# EAGLE design lc3dimmer (EAGLE 5.04)
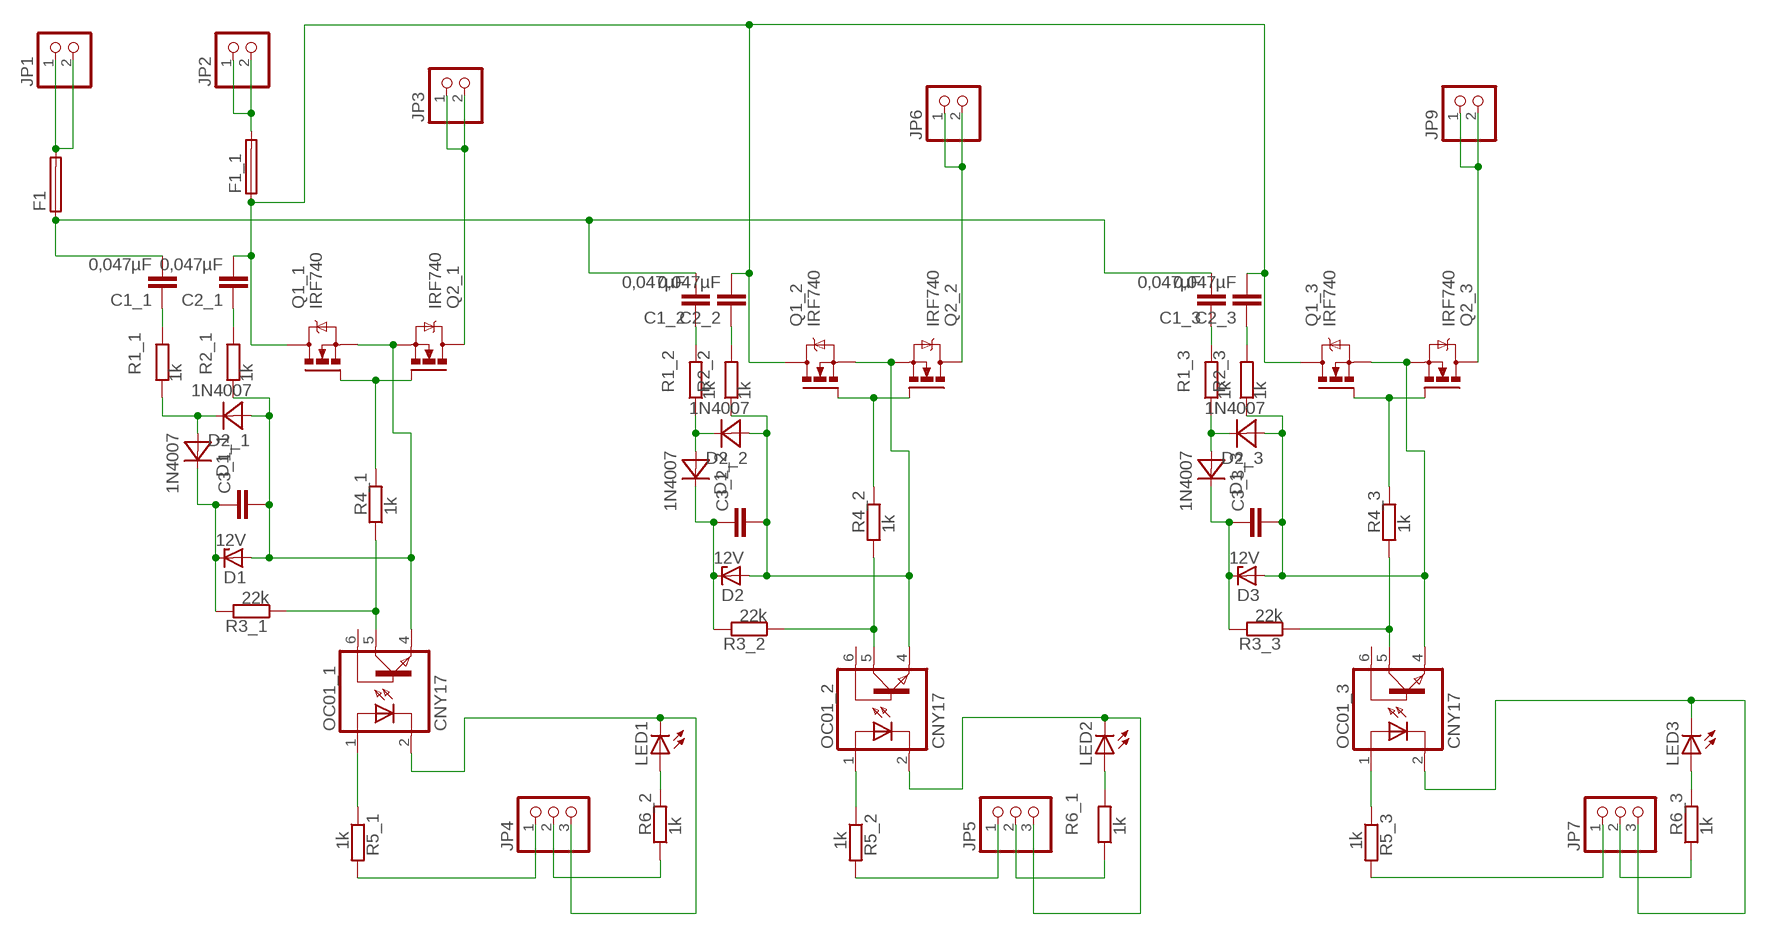
[diagram p0: schematic, sheet 1]

## Parts
C1_1  0,047µF  C-EU075-063X106  [C075-063X106]
C1_2  0,047µF  C-EU075-063X106  [C075-063X106]
C1_3  0,047µF  C-EU075-063X106  [C075-063X106]
C2_1  0,047µF  C-EU075-063X106  [C075-063X106]
C2_2  0,047µF  C-EU075-063X106  [C075-063X106]
C2_3  0,047µF  C-EU075-063X106  [C075-063X106]
C3_1  C-EUC1206  [C1206]
C3_2  C-EUC1206  [C1206]
C3_3  C-EUC1206  [C1206]
D1  12V  ZENER-DIODESOD80C  [SOD80C]
D1_1  1N4007  [DO41-7]
D1_2  1N4007  [DO41-7]
D1_3  1N4007  [DO41-7]
D2  12V  ZENER-DIODESOD80C  [SOD80C]
D2_1  1N4007  [DO41-7]
D2_2  1N4007  [DO41-7]
D2_3  1N4007  [DO41-7]
D3  12V  ZENER-DIODESOD80C  [SOD80C]
F1  19560  [19560]
F1_1  F457REICHELT  [PTF50]
JP1  PINHD-1X2  [1X02]
JP2  PINHD-1X2  [1X02]
JP3  PINHD-1X2  [1X02]
JP4  PINHD-1X3  [1X03]
JP5  PINHD-1X3  [1X03]
JP6  PINHD-1X2  [1X02]
JP7  PINHD-1X3  [1X03]
JP9  PINHD-1X2  [1X02]
LED1  LED3MM  [LED3MM]
LED2  LED3MM  [LED3MM]
LED3  LED3MM  [LED3MM]
OC01_1  CNY17  [DIL06]
OC01_2  CNY17  [DIL06]
OC01_3  CNY17  [DIL06]
Q1_1  IRF740  [TO220BV]
Q1_2  IRF740  [TO220BV]
Q1_3  IRF740  [TO220BV]
Q2_1  IRF740  [TO220BV]
Q2_2  IRF740  [TO220BV]
Q2_3  IRF740  [TO220BV]
R1_1  1k  R-EU_0207/10  [0207/10]
R1_2  1k  R-EU_0207/10  [0207/10]
R1_3  1k  R-EU_0207/10  [0207/10]
R2_1  1k  R-EU_0207/2V  [0207/2V]
R2_2  1k  R-EU_0207/10  [0207/10]
R2_3  1k  R-EU_0207/10  [0207/10]
R3_1  22k  R-EU_R1206  [R1206]
R3_2  22k  R-EU_R1206  [R1206]
R3_3  22k  R-EU_R1206  [R1206]
R4_1  1k  R-EU_0207/10  [0207/10]
R4_2  1k  R-EU_0207/10  [0207/10]
R4_3  1k  R-EU_0207/10  [0207/10]
R5_1  1k  R-EU_R1206  [R1206]
R5_2  1k  R-EU_R1206  [R1206]
R5_3  1k  R-EU_R1206  [R1206]
R6_1  1k  R-EU_R1206  [R1206]
R6_2  1k  R-EU_R1206  [R1206]
R6_3  1k  R-EU_R1206  [R1206]

## Nets
DIMMGND: C3_1.2 D1.A D2_1.A OC01_1.4(EMI) Q1_1.S Q2_1.S R2_1.1
DIMMGND1: C3_2.2 D2.A D2_2.A OC01_2.4(EMI) Q1_2.S Q2_2.S R2_2.1
DIMMGND2: C3_3.2 D2_3.A D3.A OC01_3.4(EMI) Q1_3.S Q2_3.S R2_3.1
GND: JP7.3 LED3.K(C) OC01_3.2(C)
N$1: F1_1.2 JP2.1 JP2.2
N$2: C1_1.1 R1_1.2
N$4: OC01_2.1(A) R5_2.1
N$5: OC01_2.5(COL) R3_2.1 R4_2.1
N$6: C2_1.1 R2_1.2
N$7: C1_2.1 R1_2.2
N$8: Q1_2.G Q2_2.G R4_2.2
N$9: C3_2.1 D1_2.C D2.C R3_2.2
N$10: D1_2.A D2_2.C R1_2.1
N$11: C2_2.1 R2_2.2
N$12: JP6.1 JP6.2 Q2_2.D
N$13: F1.2 JP1.1 JP1.2
N$14: OC01_3.1(A) R5_3.1
N$15: OC01_3.5(COL) R3_3.1 R4_3.1
N$16: JP3.1 JP3.2 Q2_1.D
N$18: C1_3.1 R1_3.2
N$19: Q1_3.G Q2_3.G R4_3.2
N$20: C3_3.1 D1_3.C D3.C R3_3.2
N$21: D1_3.A D2_3.C R1_3.1
N$22: C2_3.1 R2_3.2
N$23: JP9.1 JP9.2 Q2_3.D
N$24: LED1.A R6_2.2
N$25: LED2.A R6_1.2
N$26: JP4.2 R6_2.1
N$27: LED3.A R6_3.2
N$28: JP4.1 R5_1.2
N$29: JP5.1 R5_2.2
N$30: JP7.2 R6_3.1
N$31: JP5.3 LED2.K(C) OC01_2.2(C)
N$32: JP5.2 R6_1.1
N$33: JP7.1 R5_3.2
N$34: JP4.3 LED1.K(C) OC01_1.2(C)
N$37: OC01_1.1(A) R5_1.1
N$45: OC01_1.5(COL) R3_1.1 R4_1.1
N$47: Q1_1.G Q2_1.G R4_1.2
N$49: C3_1.1 D1.C D1_1.C R3_1.2
N$50: D1_1.A D2_1.C R1_1.1
NEUTRAL: C1_1.2 C1_2.2 C1_3.2 F1.1
PHASE: C2_1.2 C2_2.2 C2_3.2 F1_1.1 Q1_1.D Q1_2.D Q1_3.D
Unconnected: OC01_1.6(BAS) OC01_2.6(BAS) OC01_3.6(BAS)

## Library data of the parts
C1_1-C1_3 C2_1-C2_3 C3_1-C3_3 = rcl:C-EU: CAPACITOR, European symbol
D1-D3 = diode:ZENER-DIODE: Z-Diode
D1_1-D1_3 D2_1-D2_3 = diode:1N4007
F1 = fuse:19560: FUSE HOLDER TR5, Wickmann
F1_1 = fuse:F457: FUSE HOLDER CS, Schukat
JP1-JP3 JP6 JP9 = pinhead:PINHD-1X2: PIN HEADER
JP4 JP5 JP7 = pinhead:PINHD-1X3: PIN HEADER
LED1-LED3 = led:LED: LED OSRAM: - CHIPLED LG R971, LG N971, LY N971, LG Q971, LY Q971, LO R971, LY R971 LH N974, LH R974 LS Q976, LO Q976, LY Q976 LO Q996 - Hyper CHIPLED LW Q18S LB Q993, LB Q99A, LB R99A - SideLED LS A670, LO A670, LY A670, LG A670, LP A670 LB A673, LV A673, LT A673, LW A673 LH A674 LY A675 LS A676, LA A676, LO A676, LY A676, LW A676 LS A679, LY A679, LG A679 - Hyper Micro SIDELED® LS Y876, LA Y876, LO Y876, LY Y876 LT Y87S - SmartLED LW L88C, LW L88S LB L89C, LB L89S, LG L890 LS L89K, LO L89K, LY L89K LS L896, LA L896, LO L896, LY L896 - TOPLED LS T670, LO T670, LY T670, LG T670, LP T670 LSG T670, LSP T670, LSY T670, LOP T670, LYG T670 LG T671, LOG T671, LSG T671 LB T673, LV T673, LT T673, LW T673 LH T674 LS T676, LA T676, LO T676, LY T676, LB T676, LH T676, LSB T676, LW T676 LB T67C, LV T67C, LT T67C, LS T67K, LO T67K, LY T67K, LW E67C LS E67B, LA E67B, LO E67B, LY E67B, LB E67C, LV E67C, LT E67C LW T67C LS T679, LY T679, LG T679 LS T770, LO T770, LY T770, LG T770, LP T770 LB T773, LV T773, LT T773, LW T773 LH T774 LS E675, LA E675, LY E675, LS T675 LS T776, LA T776, LO T776, LY T776, LB T776 LHGB T686 LT T68C, LB T68C - Hyper Mini TOPLED® LB M676 - Mini TOPLED Santana® LG M470 LS M47K, LO M47K, LY M47K Source: http://www.osram.convergy.de - LUMILED® LXK2-PW12-R00, LXK2-PW12-S00, LXK2-PW14-U00, LXK2-PW14-V00 LXK2-PM12-R00, LXK2-PM12-S00, LXK2-PM14-U00 LXK2-PE12-Q00, LXK2-PE12-R00, LXK2-PE12-S00, LXK2-PE14-T00, LXK2-PE14-U00 LXK2-PB12-K00, LXK2-PB12-L00, LXK2-PB12-M00, LXK2-PB14-N00, LXK2-PB14-P00, LXK2-PB14-Q00 LXK2-PR12-L00, LXK2-PR12-M00, LXK2-PR14-Q00, LXK2-PR14-R00 LXK2-PD12-Q00, LXK2-PD12-R00, LXK2-PD12-S00 LXK2-PH12-R00, LXK2-PH12-S00 LXK2-PL12-P00, LXK2-PL12-Q00, LXK2-PL12-R00 Source: www.luxeon.com
OC01_1-OC01_3 = optocoupler:CNY17: SIEMENS OPTO COUPLER
Q1_1-Q1_3 Q2_1-Q2_3 = transistor-power:IRF740: N-CHANNEL MOS FET
R1_1-R1_3 R2_1-R2_3 R3_1-R3_3 R4_1-R4_3 R5_1-R5_3 R6_1-R6_3 = rcl:R-EU_: RESISTOR, European symbol

## Board
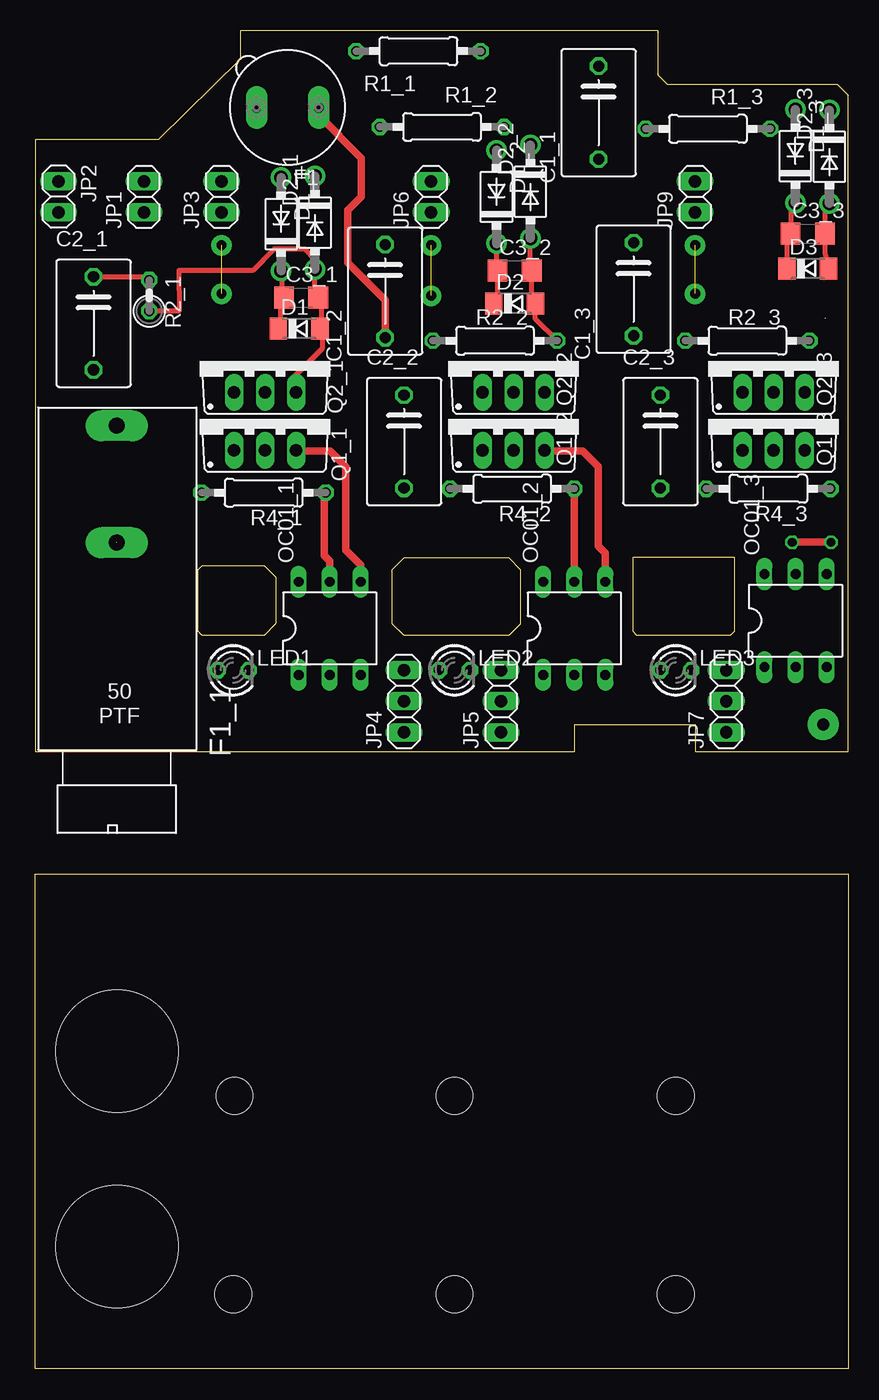
[diagram p1: board, top side]
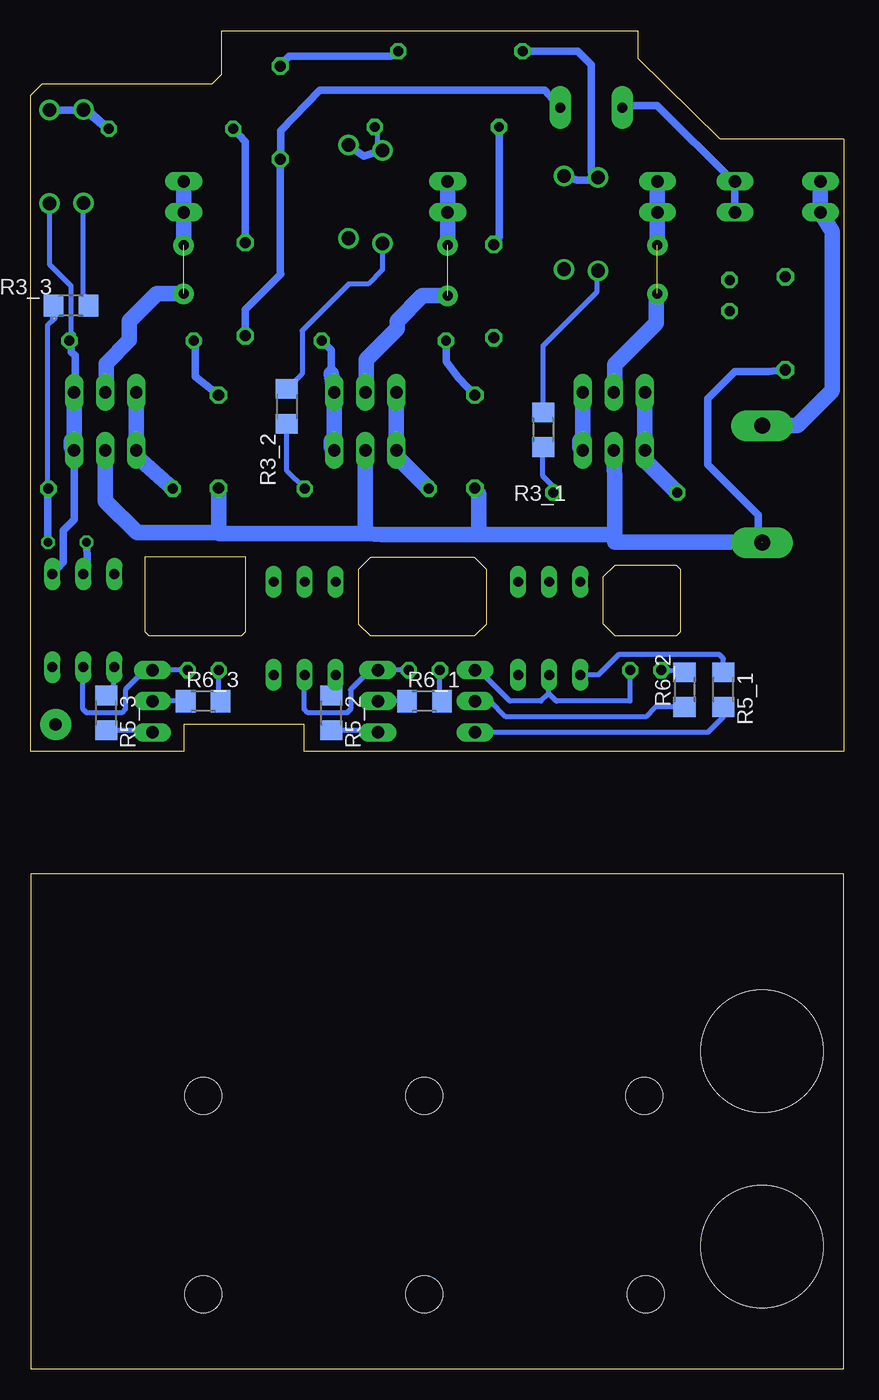
[diagram p2: board, bottom side, seen from below]

Size 66.5 x 109.5 mm. Coordinates in mm from the lower left corner, seen from the top.
Outline: 0,50.5 44.13,50.5 44.13,52.72 53.98,52.72 53.98,50.5 66.5,50.5 66.5,104.2 65.6,105.1 51.7,105.1 50.9,105.9 50.9,109.5 16.8,109.5 16.8,107.2 10.1,100.6 0,100.6 0,50.5
Outline: 48.9,60.34 48.9,66.41 57.15,66.41 57.15,60.34 56.83,60.02 49.21,60.02 48.9,60.34
Outline: 29.21,65.42 30.16,66.38 38.73,66.38 39.69,65.42 39.69,60.94 38.73,59.99 30.16,59.99 29.21,60.94 29.21,65.42
Outline: 13.65,65.74 18.73,65.74 19.68,64.79 19.68,60.98 18.73,60.02 13.65,60.02 13.34,60.34 13.34,65.42 13.65,65.74
Outline: 0,40.5 66.5,40.5 66.5,0 0,0 0,40.5
Copper layers (1*16): Top 0.035mm / dielectric 1.5mm / Bottom 0.035mm
Design rules "default": minimum track width 10mil, minimum drill 24mil, track to track 8mil, track to pad 8mil, pad to pad 8mil, via to via 8mil, smd to smd 8mil, copper to edge 40mil, drill to drill 8mil, minimum pad ring 10mil, minimum via ring 8mil, stop-mask expansion 4mil, vias tented up to drill 0mil, thermal gap 10mil
Holes 3 mm at 16.19,6.1 34.29,6.1 52.39,6.1 16.3,22.35 34.29,22.35 52.39,22.35
Holes 10 mm at 6.67,10 6.67,26
tKeepout: area 0,111.3 to 66.7,112.9; area 42.9,113 to 49.1,123.8; area 26,112.9 to 37.3,115.7; area 15.9,113 to 25.4,125.9
bRestrict: area 7.4,82.2 to 10.4,85.2

### Footprints (pad centres in the part's own frame; a part is rotated, then mirrored left to right if it is on the bottom)
C075-063X106 = drill 0.914 octagon: 1 -3.81,0; 2 3.81,0
C1206 = smd 1.6 x 1.8: 1 -1.4,0; 2 1.4,0
SOD80C = smd 1.4 x 1.8: A 1.7,0; C -1.7,0
DO41-7 = drill 1.118 round: A 3.81,0; C -3.81,0
19560 = drill 0.813 pad 1.778 long: 1 -2.54,0; 2 2.54,0
PTF50 = drill 1.321 pad 2.54 long: 1 -4.48,0; 2 5.08,0
1X02 = drill 1.016 long: 1 -1.27,0; 2 1.27,0
1X03 = drill 1.016 long: 1 -2.54,0; 2 0,0; 3 2.54,0
LED3MM = drill 0.813 octagon: A -1.27,0; K 1.27,0
DIL06 = drill 0.813 long: 1 -2.54,-3.81; 2 0,-3.81; 3 2.54,-3.81; 4 2.54,3.81; 5 0,3.81; 6 -2.54,3.81
TO220BV = drill 1.016 long: D 0,-2.54; G -2.54,-2.54; S 2.54,-2.54
0207/10 = drill 0.813 octagon: 1 -5.08,0; 2 5.08,0
0207/2V = drill 0.813 octagon: 1 -1.27,0; 2 1.27,0
R1206 = smd 1.6 x 1.803: 1 -1.422,0; 2 1.422,0

### Placement (x,y rotation side)
C1_1  46.08,102.78 270 top
C1_2  28.62,88.18 270 top
C1_3  48.94,88.34 270 top
C2_1  4.77,85.55 270 top
C2_2  30.17,75.87 270 top
C2_3  51.12,75.87 270 top
C3_1  21.75,87.65 0 top
C3_2  39.21,89.87 0 top
C3_3  63.18,92.89 0 top
D1  21.59,85.11 0 top
D1_1  20.11,93.66 90 top
D1_2  37.73,95.88 90 top
D1_3  62.17,99.22 90 top
D2  39.21,87.17 0 top
D2_1  22.88,93.78 270 top
D2_2  40.5,96.32 270 top
D2_3  64.95,99.18 270 top
D3  63.18,90.03 0 top
F1  20.64,103.2 180 top
F1_1  6.67,72.09 90 top
JP1  8.89,95.9 90 top
JP2  1.91,95.9 270 top
JP3  15.24,95.9 90 top
JP4  30.16,54.63 90 top
JP5  38.1,54.63 90 top
JP6  32.38,95.9 90 top
JP7  56.52,54.63 90 top
JP9  53.98,95.9 90 top
LED1  16.19,57.17 0 top
LED2  34.29,57.17 0 top
LED3  52.39,57.17 0 top
OC01_1  24.08,60.59 0 top
OC01_2  44.09,60.59 0 top
OC01_3  62.18,61.23 0 top
Q1_1  18.8,77.71 0 top
Q1_2  39.12,77.71 0 top
Q1_3  60.39,77.71 0 top
Q2_1  18.8,82.44 0 top
Q2_2  39.12,82.44 0 top
Q2_3  60.39,82.44 0 top
R1_1  31.34,107.81 0 top
R1_2  33.27,101.62 180 top
R1_3  55.02,101.46 180 top
R2_1  9.33,87.83 90 top
R2_2  37.6,84.12 180 top
R2_3  58.24,84.12 180 top
R3_1  24.58,76.84 90 bottom
R3_2  45.53,78.75 90 bottom
R3_3  63.19,86.98 0 bottom
R4_1  18.68,71.69 180 top
R4_2  39,72.01 180 top
R4_3  59.96,72.01 180 top
R5_1  9.84,55.58 270 bottom
R5_2  41.91,53.67 270 bottom
R5_3  60.33,53.67 270 bottom
R6_1  34.29,54.63 0 bottom
R6_2  13.02,55.58 90 bottom
R6_3  52.39,54.63 0 bottom

### Tracks (layer width: path | path; a pad name or v marks a point on that pad's centre or on a via)
DIMMGND
  Top 0.406: Q2_1.S 21.34,81.37 23.5,83.52 23.5,85.38 D1.A 23.45,85.9 23.45,87.35 C3_1.2 22.88,87.92 D2_1.A 22.88,90.8 22.07,91.62 19.53,91.62 17.78,89.87 15.4,89.87 11.76,89.87 11.77,86.56 R2_1.1
  Top 0.61: OC01_1.4 26.62,65.79 25.4,67.01 25.4,73.84 24.13,75.11 21.4,75.11 Q1_1.S
  Bottom 1.27: Q2_1.S 21.34,76.15 21.59,75.9 21.59,75.41 Q1_1.S
DIMMGND1
  Top 0.406: D2_2.A 40.5,89.98 C3_2.2 40.61,87.95 D2.A 40.91,85.89 R2_2.1
  Top 0.61: OC01_2.4 46.62,66.74 46.04,67.33 46.04,73.84 44.77,75.11 41.72,75.11 Q1_2.S
  Bottom 0.61: 41.91,81.42 41.91,83.35 R2_2.1 | 40.82,92.59 40.64,93.05 40.64,92.97 D2_2.A
  Bottom 1.27: 41.91,81.42 Q2_2.S 41.66,76.15 41.91,75.9 41.91,75.41 Q1_2.S
DIMMGND2  (via drill 0.6)
  Top 0.406: v65.09,95.23 64.58,94.73 C3_3.2 64.58,91.28 D3.A
  Bottom 0.406: R2_3.1 63,84.65 63.18,84.79 63.18,88.6 64.95,90.37 D2_3.A v65.09,95.23
  Bottom 0.61: 62.87,80.47 62.87,82.88 63.18,83.2 63.18,83.35 R2_3.1 | Q1_3.S 62.93,69.48 63.82,68.6 63.82,66.04 OC01_3.4
  Bottom 1.27: 62.87,80.47 Q2_3.S 62.93,76.15 63.18,75.9 63.18,75.41 Q1_3.S
GND
  Bottom 0.406: LED3.K JP7.3 57.15,57.17 58.74,55.58 58.74,53.99 59.05,53.67 61.91,53.67 62.23,53.99 62.23,56.73 OC01_3.2
N$1
  Bottom 1.27: F1_1.2 3.81,77.17 0.95,80.03 0.95,93.05 JP2.2 JP2.1
N$2
  Bottom 0.61: R1_1.2 37.01,107.39 45.35,107.39 46.04,106.7 C1_1.1
N$4
  Bottom 0.406: OC01_2.1 41.55,55.46 R5_2.1
N$5
  Top 0.61: OC01_2.5 R4_2.1
  Bottom 0.406: R4_2.1 45.53,73.46 R3_2.1
N$6
  Top 0.406: R2_1.2 9.07,89.36 C2_1.1
N$7
  Bottom 0.61: R1_2.2 28.19,92.58 C1_2.1
N$8
  Bottom 1.27: Q2_2.G Q1_2.G 36.58,74.67 R4_2.2
N$9
  Top 0.406: D1_2.C 37.73,89.95 C3_2.1 37.81,87.95 D2.C
  Bottom 0.406: R3_2.2 44.29,81.41 44.29,84.95 40.48,88.76 38.89,88.76 37.73,89.93 D1_2.C
N$10
  Bottom 0.406: R1_2.1 38.1,101.21 38.1,99.71 37.73,99.34 D1_2.A
  Bottom 0.61: D1_2.A 39.27,99.22 D2_2.C
N$11
  Bottom 0.61: C2_2.1 31.52,81.11 32.5,82.4 32.5,84.1 R2_2.2
N$12  (via drill 0.8 pad 1.68)  (1 unrouted)
  Bottom 1.27: Q2_2.D 39.05,79.97 39.05,82.57 36.51,85.11 36.51,85.74 34.45,87.81 v32.38,87.81 | JP6.2 JP6.1 v32.38,91.93
N$13
  Bottom 0.61: JP1.1 JP1.2 9.05,97.17 15.24,103.36 17.94,103.36 F1.2
N$14
  Bottom 0.406: R5_3.1 59.69,55.78 OC01_3.1
N$15  (via drill 0.7)  (1 unrouted)
  Top 0.61: v61.91,67.64 v65.09,67.64
  Bottom 0.406: 64.58,85.93 64.59,86.25 | R4_3.1 65.09,72.06 65.09,85.42 64.61,85.9 64.61,85.96
  Bottom 0.61: OC01_3.5 61.87,66.01 v61.91,67.64 | v65.09,67.64 65.09,71.32 R4_3.1 | 64.61,85.96 R3_3.1
N$16  (via drill 0.8 pad 1.68)  (1 unrouted)
  Bottom 1.27: Q2_1.D 18.73,79.97 18.73,82.17 15.35,85.55 15.35,87.97 v15.24,87.97 | JP3.2 JP3.1 v15.24,91.93
N$17  (via drill 1 pad 2.54)
  other vias: 64.45,52.72
N$18
  Bottom 0.61: C1_3.1 48.94,100.39 R1_3.2
N$19
  Bottom 1.27: Q2_3.G Q1_3.G 57.85,74.67 R4_3.2
N$20
  Top 0.406: D1_3.C 61.78,95.02 C3_3.1 61.48,92.9 D3.C
  Bottom 0.406: 61.74,86.36 61.73,86.56 61.28,87.01 62.17,87.91 D1_3.C
  Bottom 0.61: R3_3.2 61.74,86.48 61.74,86.36
N$21
  Bottom 0.61: R1_3.1 59.93,101.46 | R1_3.1 59.95,101.15 D1_3.A | R1_3.1 61.77,102.97 D2_3.C
N$22
  Bottom 0.61: R2_3.2 52.74,84.12 53.02,84.16 53.02,81.18 C2_3.1
N$23  (via drill 0.8 pad 1.68)  (1 unrouted)
  Bottom 1.27: Q2_3.D 60.33,79.97 60.33,82.25 58.42,84.16 58.42,85.74 56.2,87.97 v53.98,87.97 | JP9.2 JP9.1 v53.98,91.93
N$24
  Bottom 0.406: R6_2.2 LED1.A
N$25
  Bottom 0.406: LED2.A 33.02,54.78 R6_1.2
N$26
  Bottom 0.406: R6_2.1 15.39,54.16 16.19,53.36 27.62,53.36 28.89,54.63 JP4.2
N$27
  Bottom 0.406: LED3.A 51.12,54.78 R6_3.2
N$28
  Bottom 0.406: R5_1.2 9.84,53.36 11.11,52.09 JP4.1
N$29
  Bottom 0.406: R5_2.2 38.89,52.25 JP5.1
N$30
  Bottom 0.406: R6_3.1 JP7.2
N$31
  Bottom 0.406: LED2.K JP5.3 38.73,57.17 40.32,55.58 40.32,53.99 40.64,53.67 43.81,53.67 44.13,53.99 44.13,56.1 OC01_2.2
N$32
  Bottom 0.406: 35.71,54.16 R6_1.1 JP5.2
N$33
  Bottom 0.406: R5_3.2 56.98,52.25 JP7.1
N$34
  Bottom 0.406: LED1.K 17.46,54.63 23.5,54.63 24.13,55.26 | 24.13,55.26 24.13,56.73 OC01_1.2 | JP4.3 29.84,57.17 27.3,54.63 24.77,54.63 24.13,55.26
N$37
  Bottom 0.406: OC01_1.1 20.07,56.78 18.41,58.44 10.16,58.44 9.84,58.12 R5_1.1
N$45
  Top 0.61: OC01_1.5 24.08,66.11 23.65,66.53 23.65,71.59 R4_1.1
  Bottom 0.406: R4_1.1 23.76,72.2 24.61,73.04 24.61,75.39 R3_1.1
N$47
  Bottom 1.27: Q2_1.G Q1_1.G 16.26,74.35 R4_1.2
N$49
  Top 0.406: D1_1.C 20.16,89.79 20.16,87.84 C3_1.1 20.05,87.35 20.05,85.9 D1.C
  Bottom 0.406: 20.16,89.79 20.16,89.08 | R3_1.2 24.58,83.71 20.16,88.12 20.16,89.79 | 20.16,89.79 D1_1.C
N$50
  Bottom 0.61: R1_1.1 21.75,107.81 20.64,106.7 20.64,98 20.54,97.27 | D1_1.A 20.54,97.27 | D2_1.C 21.77,97.27 20.54,97.27
NEUTRAL
  Top 0.406: 23.18,102.57 F1.1
  Top 0.61: C1_2.2 28.62,87.44 25.56,90.5 25.56,94.79 26.67,95.9 26.67,99.08 23.18,102.57
  Bottom 0.61: 23.18,102.57 F1.1 24.45,104.63 42.86,104.63 46.04,101.3 46.04,99.72 C1_1.2 46.08,89.6 46.04,89.55 48.94,86.65 C1_3.2
PHASE  (1 unrouted)
  Bottom 0.61: 6.99,67.64 6.99,69.87 11.11,74 11.11,79.39 8.89,81.61 6.16,81.61 C2_1.2
  Bottom 1.27: Q1_3.D 60.39,71.02 57.78,68.41 51.15,68.41 51.12,68.38 | Q1_1.D 18.73,72.72 18.73,67.64 | 6.67,67.64 6.99,67.64 18.73,67.64 | 39.12,68.35 Q1_2.D | 39.12,68.35 37.78,68.28 29.84,68.28 | 29.84,68.91 29.84,71.58 C2_2.2 | 51.12,68.38 51.12,71.58 C2_3.2 | 39.12,68.35 51.09,68.35 51.12,68.38 | 29.84,68.91 29.84,68.28 | 29.84,68.28 29.84,68.91 | 29.84,68.28 18.73,68.28 18.73,67.64